# EAGLE design Vocoder input amplifier (with THAT limiter) (EAGLE 7.2.0)
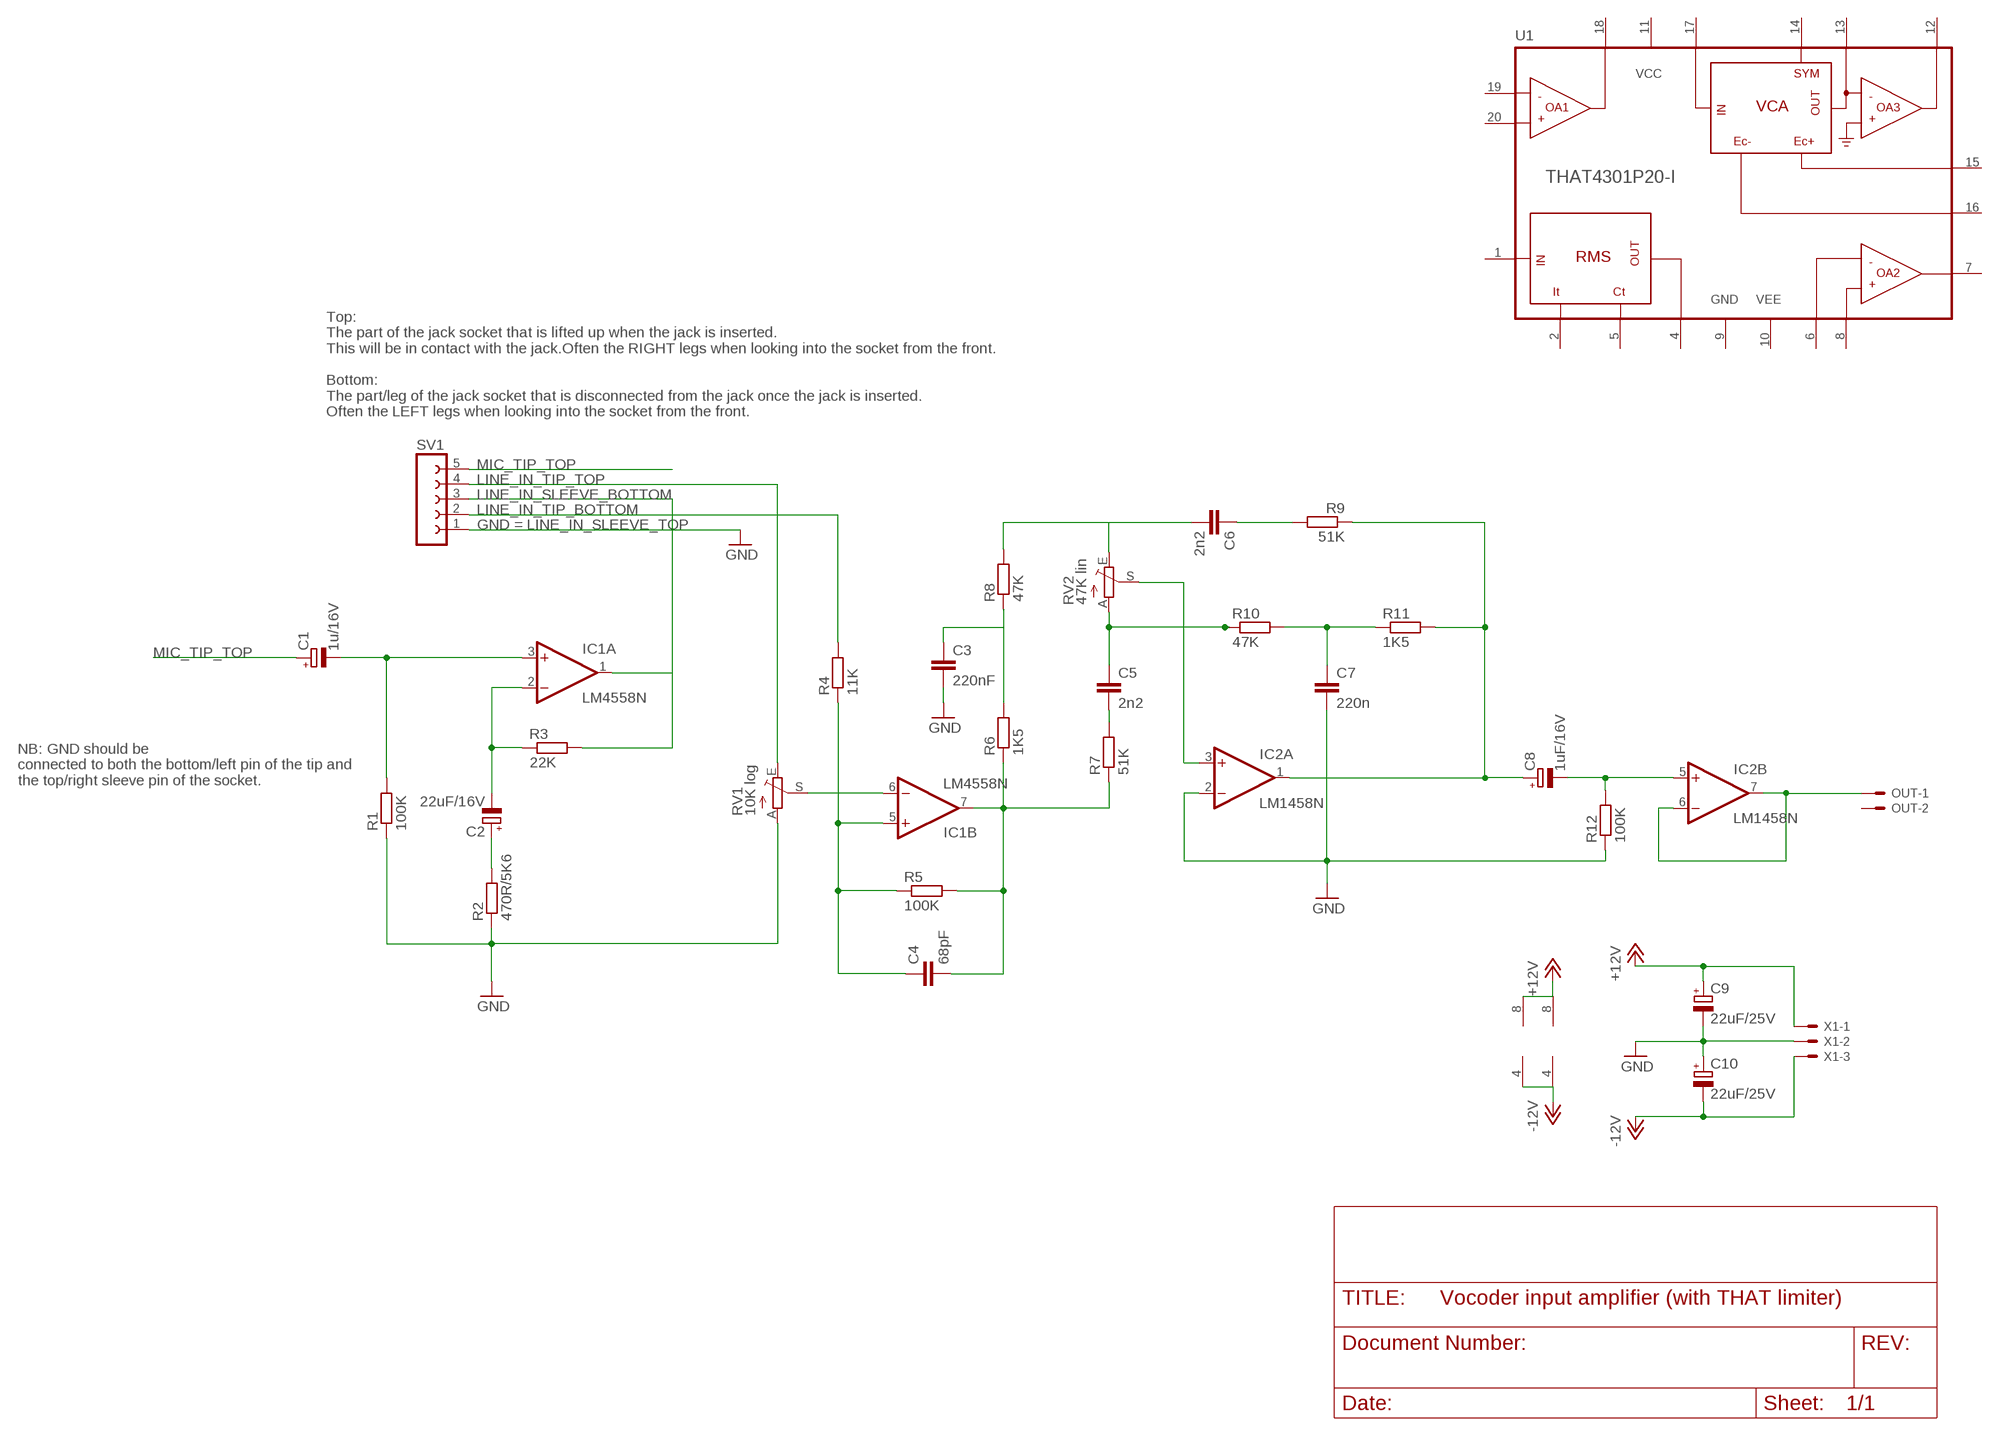
[diagram p0: schematic, sheet 1]

## Parts
C1  1u/16V  CPOL-EUE2.5-5  [E2,5-5]
C2  22uF/16V  CPOL-EUE2.5-5  [E2,5-5]
C3  220nF  C-EU050-030X075  [C050-030X075]
C4  68pF  C-EU025-025X050  [C025-025X050]
C5  2n2  C-EU050-030X075  [C050-030X075]
C6  2n2  C-EU050-030X075  [C050-030X075]
C7  220n  C-EU050-030X075  [C050-030X075]
C8  1uF/16V  CPOL-EUE2.5-5  [E2,5-5]
C9  22uF/25V  CPOL-EUE2.5-5  [E2,5-5]
C10  22uF/25V  CPOL-EUE2.5-5  [E2,5-5]
IC1  LM4558N  [DIL08]
IC2  LM1458N  [DIL08]
OUT  22-23-2021  [22-23-2021]
R1  100K  R-EU_0207/7  [0207/7]
R2  470R/5K6  R-EU_0207/7  [0207/7]
R3  22K  R-EU_0207/7  [0207/7]
R4  11K  R-EU_0207/7  [0207/7]
R5  100K  R-EU_0207/7  [0207/7]
R6  1K5  R-EU_0207/7  [0207/7]
R7  51K  R-EU_0207/7  [0207/7]
R8  47K  R-EU_0207/7  [0207/7]
R9  51K  R-EU_0207/7  [0207/7]
R10  47K  R-EU_0207/7  [0207/7]
R11  1K5  R-EU_0207/7  [0207/7]
R12  100K  R-EU_0207/7  [0207/7]
RV1  10K log  TRIM_EU-CIP20C-6MM  [CIP20C-6MM]
RV2  47K lin  TRIM_EU-CIP20C-6MM  [CIP20C-6MM]
SV1  FE05-1  [FE05-1]
U1  THAT4301P20-I  [DIL20]
X1  KK-156-3  [KK-156-3]

## Nets
+12V: C9.+ IC1.8(P:V+) IC2.8(P:V+) X1.1
-12V: C10.- IC1.4(P:V-) IC2.4(P:V-) X1.3
GND: C3.2 C7.2 C9.- C10.+ IC2.2(A:-IN) R1.1 R2.1 R12.1 RV1.A SV1.1 X1.2
LINE_IN_SLEEVE_BOTTOM: R4.2 SV1.2
LINE_IN_TIP_BOTTOM: IC1.1(A:OUT) R3.2 SV1.3
LINE_IN_TIP_TOP: RV1.E SV1.4
MIC_TIP_TOP: C1.+ SV1.5
N$1: C2.- IC1.2(A:-IN) R3.1
N$2: C1.- IC1.3(A:+IN) R1.2
N$3: C2.+ R2.2
N$6: C3.1 R6.2 R8.1
N$7: C4.1 IC1.5(B:+IN) R4.1 R5.1
N$8: IC1.6(B:-IN) RV1.S
N$10: C4.2 IC1.7(B:OUT) R5.2 R6.1 R7.1
N$11: C5.2 R7.2
N$12: C6.2 R8.2 RV2.E
N$13: IC2.3(A:+IN) RV2.S
N$14: C5.1 R10.1 RV2.A
N$15: C7.1 R10.2 R11.1
N$16: C8.- IC2.5(B:+IN) R12.2
N$17: C6.1 R9.2
N$18: C8.+ IC2.1(A:OUT) R9.1 R11.2
N$19: IC2.6(B:-IN) IC2.7(B:OUT) OUT.1
Unconnected: OUT.2 U1.1(RMS_IN) U1.2(IT) U1.4(RMS_OUT) U1.5(CT) U1.6(OA2_-IN) U1.7(OA2_OUT) U1.8(OA2_+IN) U1.12(OA3_OUT) U1.13(VCA_OUT) U1.14(SYM) U1.15(EC+) U1.16(EC-) U1.17(VCA_IN) U1.18(OA1_OUT) U1.19(OA1_-IN) U1.20(OA1_+IN)

## Notes on the sheet
- Top: 
  The part of the jack socket that is lifted up when the jack is inserted.
  This will be in contact with the jack.Often the RIGHT legs when looking into the socket from the front.
  
  Bottom: 
  The part/leg of the jack socket that is disconnected from the jack once the jack is inserted. 
  Often the LEFT legs when looking into the socket from the front.
- = LINE_IN_SLEEVE_TOP
- NB: GND should be 
  connected to both the bottom/left pin of the tip and 
  the top/right sleeve pin of the socket.

## Power pins joined to a net without a drawn wire
GND: U1.9(GND)
VCC: U1.11(VCC)
VEE: U1.10(VEE)

## Library data of the parts
C1 C2 C8-C10 = resistor:CPOL-EU: POLARIZED CAPACITOR, European symbol
C3 C5-C7 = resistor:C-EU: CAPACITOR, European symbol
C4 = rcl:C-EU: CAPACITOR, European symbol
IC1 = linear:*4558: OP AMP
IC2 = linear:*1458: OP AMP
OUT = con-molex:22-23-2021: .100" (2.54mm) Center Header - 2 Pin; MF: MOLEX; MPN: 22-23-2021; OC_FARNELL: 1462926; OC_NEWARK: 25C3832
R1-R12 = resistor:R-EU_: RESISTOR, European symbol
RV1 RV2 = pot:TRIM_EU-: POTENTIOMETER
SV1 = con-lsta:FE05-1: FEMALE HEADER; OC_FARNELL: unknown; OC_NEWARK: unknown
U1 = that-corp-edit:THAT4301: THAT Analog Engine® IC Dynamics Processor
X1 = con-molex:KK-156-3: KK 156 HEADER Source: http://www.molex.com/pdm_docs/sd/026604100_sd.pdf; OC_FARNELL: unknown; OC_NEWARK: unknown

## Board
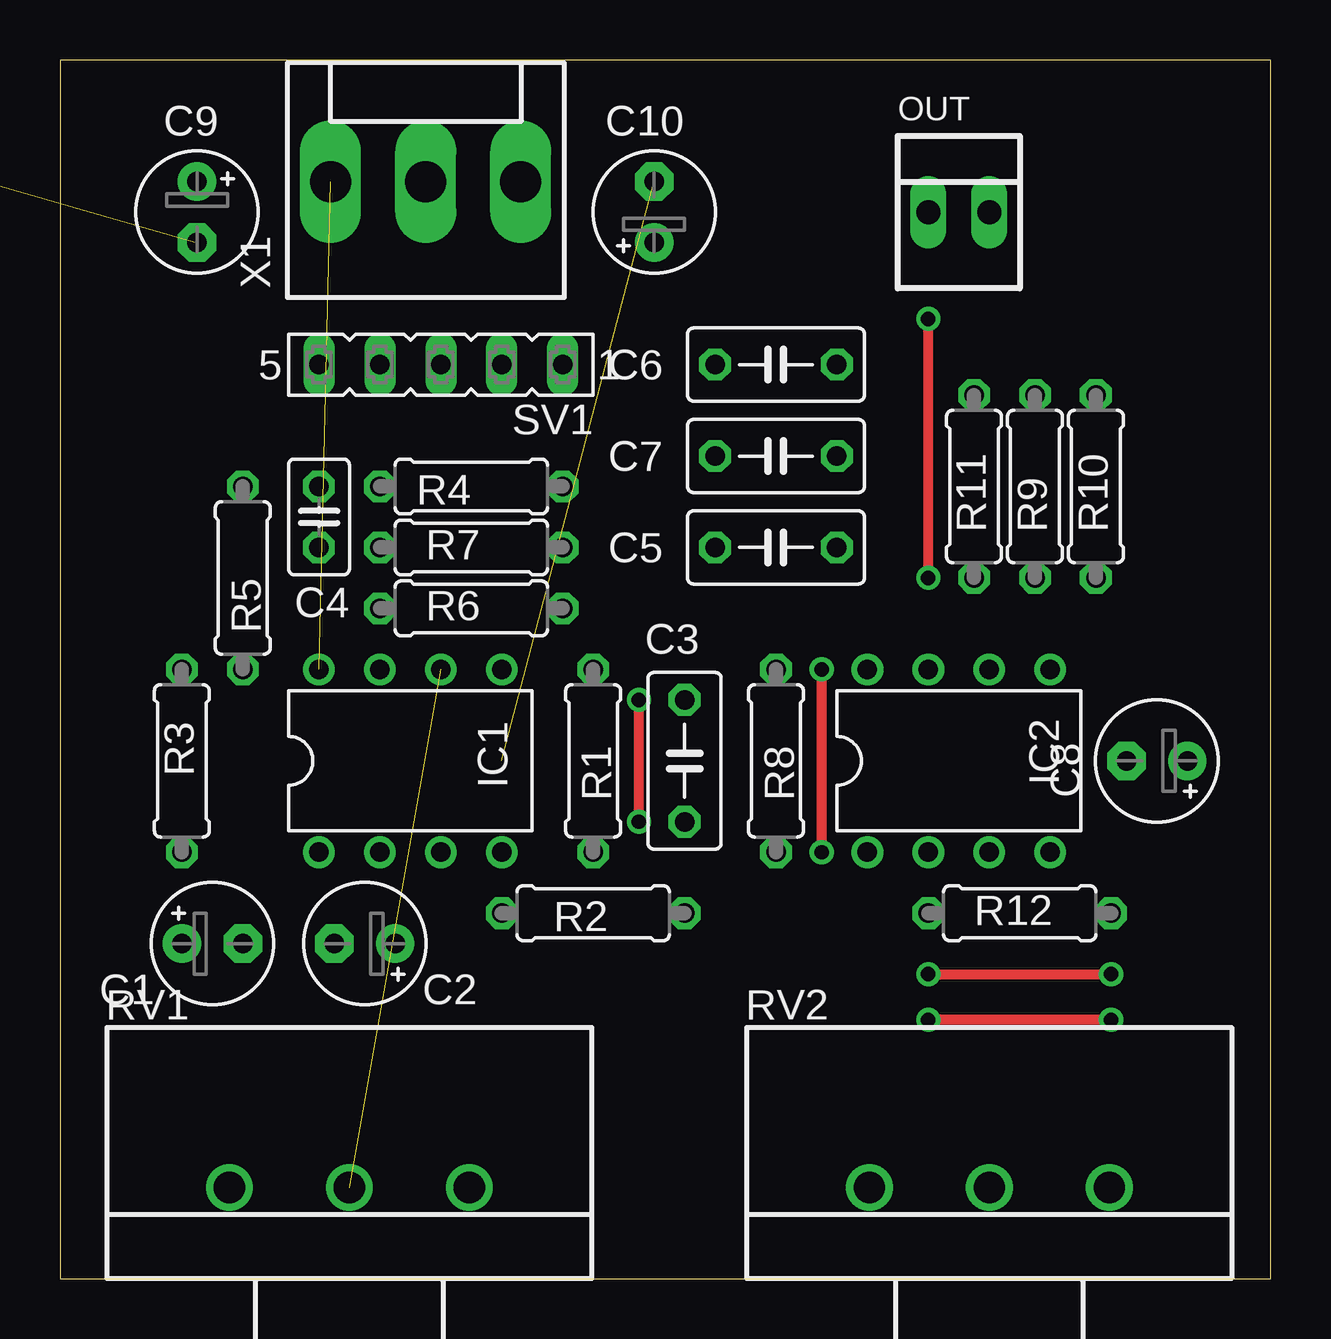
[diagram p1: board, top side]
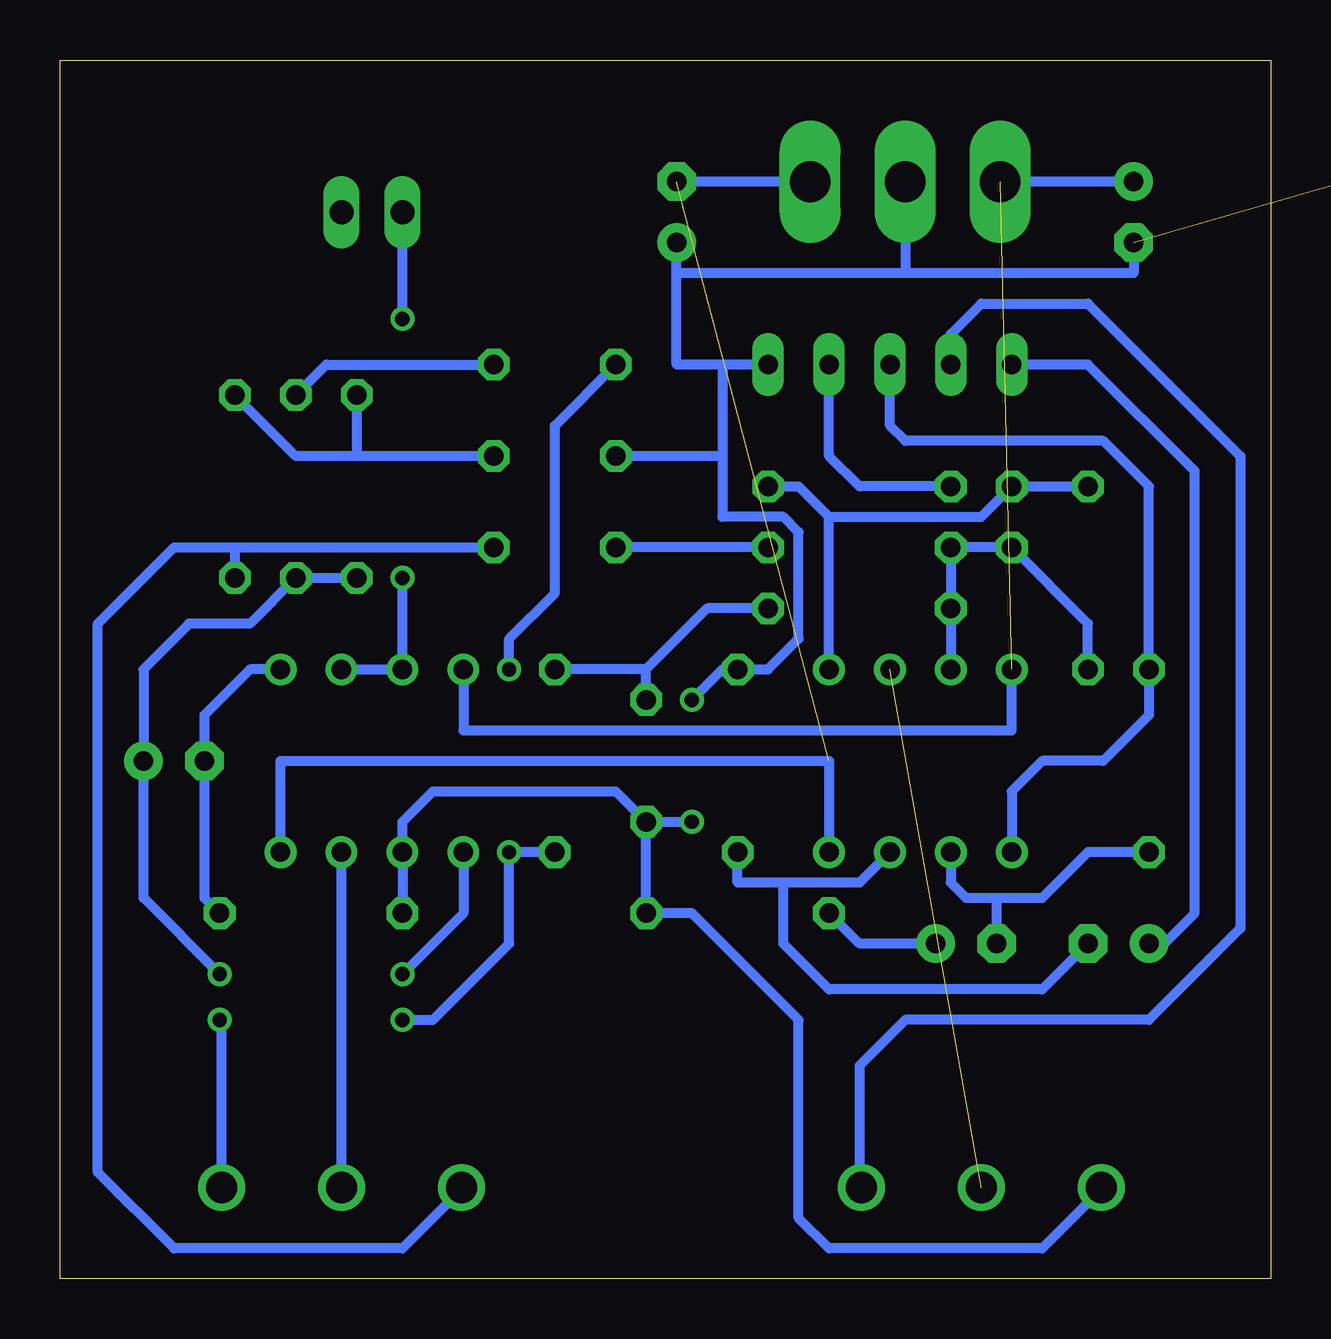
[diagram p2: board, bottom side, seen from below]

Size 50.47 x 50.79 mm. Coordinates in mm from the lower left corner, seen from the top.
Outline: 0,0 50.47,0 50.47,50.79 0,50.79 0,0
Copper layers (1*16): Top 0.035mm / dielectric 1.5mm / Bottom 0.035mm
Design rules "default": minimum track width 10mil, minimum drill 24mil, track to track 8mil, track to pad 8mil, pad to pad 8mil, via to via 8mil, smd to smd 8mil, copper to edge 40mil, drill to drill 8mil, minimum pad ring 10mil, minimum via ring 8mil, stop-mask expansion 4mil, vias tented up to drill 0mil, thermal gap 10mil

### Footprints (pad centres in the part's own frame; a part is rotated, then mirrored left to right if it is on the bottom)
E2,5-5 = drill 0.813 pad 1.6: + -1.27,0 | drill 0.813 pad 1.6 octagon: - 1.27,0
C050-030X075 = drill 0.813 octagon: 1 -2.54,0; 2 2.54,0
C025-025X050 = drill 0.813 octagon: 1 -1.27,0; 2 1.27,0
DIL08 = drill 0.813 pad 1.27: 1 -3.81,-3.81; 2 -1.27,-3.81; 3 1.27,-3.81; 4 3.81,-3.81; 5 3.81,3.81; 6 1.27,3.81; 7 -1.27,3.81; 8 -3.81,3.81
22-23-2021 = drill 1 long: 1 -1.27,0; 2 1.27,0
0207/7 = drill 0.813 octagon: 1 -3.81,0; 2 3.81,0
CIP20C-6MM = drill 1.3 pad 1.93: A -5,0; E 5,0; S 0,0
FE05-1 = drill 0.813 long: 1 -5.08,0; 2 -2.54,0; 3 0,0; 4 2.54,0; 5 5.08,0
DIL20 = drill 0.813 long: 1 -11.43,-3.81; 2 -8.89,-3.81; 3 -6.35,-3.81; 4 -3.81,-3.81; 5 -1.27,-3.81; 6 1.27,-3.81; 7 3.81,-3.81; 8 6.35,-3.81; 9 8.89,-3.81; 10 11.43,-3.81; 11 11.43,3.81; 12 8.89,3.81; 13 6.35,3.81; 14 3.81,3.81; 15 1.27,3.81; 16 -1.27,3.81; 17 -3.81,3.81; 18 -6.35,3.81; 19 -8.89,3.81; 20 -11.43,3.81
KK-156-3 = drill 1.7 pad 2.184 long: 1 -3.96,0; 2 0,0; 3 3.96,0

### Placement (x,y rotation side)
C1  6.35,13.97 0 top
C2  12.7,13.97 180 top
C3  26.04,21.59 270 top
C4  10.79,31.75 270 top
C5  29.84,30.48 180 top
C6  29.84,38.1 180 top
C7  29.84,34.29 180 top
C8  45.72,21.59 180 top
C9  5.71,44.45 270 top
C10  24.77,44.45 90 top
IC1  14.61,21.59 0 top
IC2  37.47,21.59 0 top
OUT  37.47,44.45 0 top
R1  22.23,21.59 270 top
R2  22.23,15.24 180 top
R3  5.08,21.59 90 top
R4  17.14,33.02 180 top
R5  7.62,29.21 270 top
R6  17.14,27.94 0 top
R7  17.14,30.48 0 top
R8  29.84,21.59 270 top
R9  40.64,33.02 90 top
R10  43.18,33.02 90 top
R11  38.1,33.02 270 top
R12  40.01,15.24 0 top
RV1  12.06,3.81 0 top
RV2  38.73,3.81 0 top
SV1  15.88,38.1 180 top
U1  -82.55,69.85 0 top  (outside the outline)
X1  15.24,45.72 0 top

### Tracks (layer width: path | path; a pad name or v marks a point on that pad's centre or on a via)
+12V  (1 unrouted)
  Bottom 0.406: IC2.8 33.66,22.86 10.79,22.86 IC1.8 | C9.+ X1.1
-12V  (1 unrouted)
  Bottom 0.406: IC2.4 41.27,21.59 18.41,21.59 IC1.4 | X1.3 C10.-
GND  (via drill 0.6)  (1 unrouted)
  Top 0.406: v24.13,19.05 v24.13,24.13
  Bottom 0.406: C3.2 27.3,20.32 34.92,20.32 36.2,19.05 IC2.2 R12.1 | 22.86,34.29 C7.2 | C3.2 v24.13,19.05 | v24.13,24.13 22.86,25.4 R1.1 20.95,25.4 19.68,26.67 19.68,31.11 20.32,31.75 22.86,31.75 22.86,34.29 | C3.2 R2.1 24.13,15.24 19.68,10.79 19.68,2.54 18.41,1.27 9.53,1.27 7.07,3.73 RV1.A | 22.86,38.1 22.86,34.29 | SV1.1 22.86,38.1 | X1.2 15.24,41.91 | 15.24,41.91 24.77,41.91 | 24.77,41.91 C10.+ | C9.- 5.71,41.91 15.24,41.91 | 22.86,38.1 24.77,38.1 24.77,41.91
LINE_IN_SLEEVE_BOTTOM
  Bottom 0.406: R4.2 17.14,33.02 18.41,34.29 SV1.2
LINE_IN_TIP_BOTTOM
  Bottom 0.406: IC1.1 10.79,20.32 9.53,21.59 6.99,21.59 5.08,23.5 R3.2 5.08,33.02 6.99,34.92 15.24,34.92 15.88,35.56 SV1.3
LINE_IN_TIP_TOP
  Bottom 0.406: SV1.4 13.34,39.37 12.06,40.64 7.62,40.64 1.27,34.29 1.27,14.61 5.08,10.79 15.24,10.79 17.14,8.89 17.14,3.89 RV1.E
MIC_TIP_TOP
  Bottom 0.406: C1.+ 4.45,13.97 3.17,15.24 3.17,33.66 7.62,38.1 SV1.5
N$1
  Bottom 0.406: R3.1 7.62,17.78 9.53,15.88 11.43,15.88 | 11.43,15.88 C2.- | IC1.2 13.34,16.51 12.7,15.88 11.43,15.88
N$2
  Bottom 0.406: IC1.3 17.14,16.51 20.32,16.51 | 20.32,16.51 22.23,16.51 R1.2 | C1.- 9.53,12.06 18.41,12.06 20.32,13.97 20.32,16.51
N$3
  Bottom 0.406: C2.+ 17.14,13.97 R2.2
N$6
  Bottom 0.406: C3.1 26.04,25.4 | 26.04,25.4 R8.1 | R6.2 23.5,27.94 26.04,25.4
N$7
  Bottom 0.406: R5.1 C4.1 12.06,31.75 18.41,31.75 | IC1.5 18.41,31.75 | R4.1 19.68,33.02 18.41,31.75
N$8  (1 unrouted)
N$10
  Bottom 0.406: IC1.7 R6.1 R7.1 C4.2 7.62,27.3 R5.2
N$11
  Bottom 0.406: R7.2 C5.2
N$12  (via drill 0.6)
  Top 0.406: v31.75,17.78 v31.75,25.4 | v43.81,10.79 v36.2,10.79
  Bottom 0.406: R8.2 v31.75,17.78 31.75,13.97 34.92,10.79 v36.2,10.79 | v31.75,25.4 31.75,26.67 29.84,28.57 29.84,35.56 C6.2 | RV2.E 43.73,10.71 v43.81,10.79
N$13
  Bottom 0.406: RV2.S IC2.3
N$14
  Bottom 0.406: 43.18,30.48 C5.1 | RV2.A 33.73,3.73 36.2,1.27 45.72,1.27 48.9,4.45 48.9,27.3 45.72,30.48 43.18,30.48 | 43.18,30.48 R10.1
N$15
  Bottom 0.406: C7.1 38.1,34.29 | 38.1,34.29 40.64,34.29 R10.2 | R11.1 38.1,34.29
N$16
  Bottom 0.406: R12.2 44.45,15.88 C8.- 44.45,23.5 42.55,25.4 IC2.5
N$17
  Bottom 0.406: R9.2 39.37,38.1 C6.1
N$18  (via drill 0.6)
  Top 0.406: v36.2,12.7 v43.81,12.7
  Bottom 0.406: R11.2 R9.1 42.55,27.3 45.09,27.3 46.99,25.4 C8.+ 46.99,15.88 v43.81,12.7 | IC2.1 33.66,15.24 v36.2,12.7
N$19  (via drill 0.6)
  Top 0.406: v36.2,29.21 v36.2,40.01
  Bottom 0.406: IC2.6 IC2.7 v36.2,29.21 | v36.2,40.01 OUT.1